# EAGLE schematic Schematic (EAGLE 9.1.3)
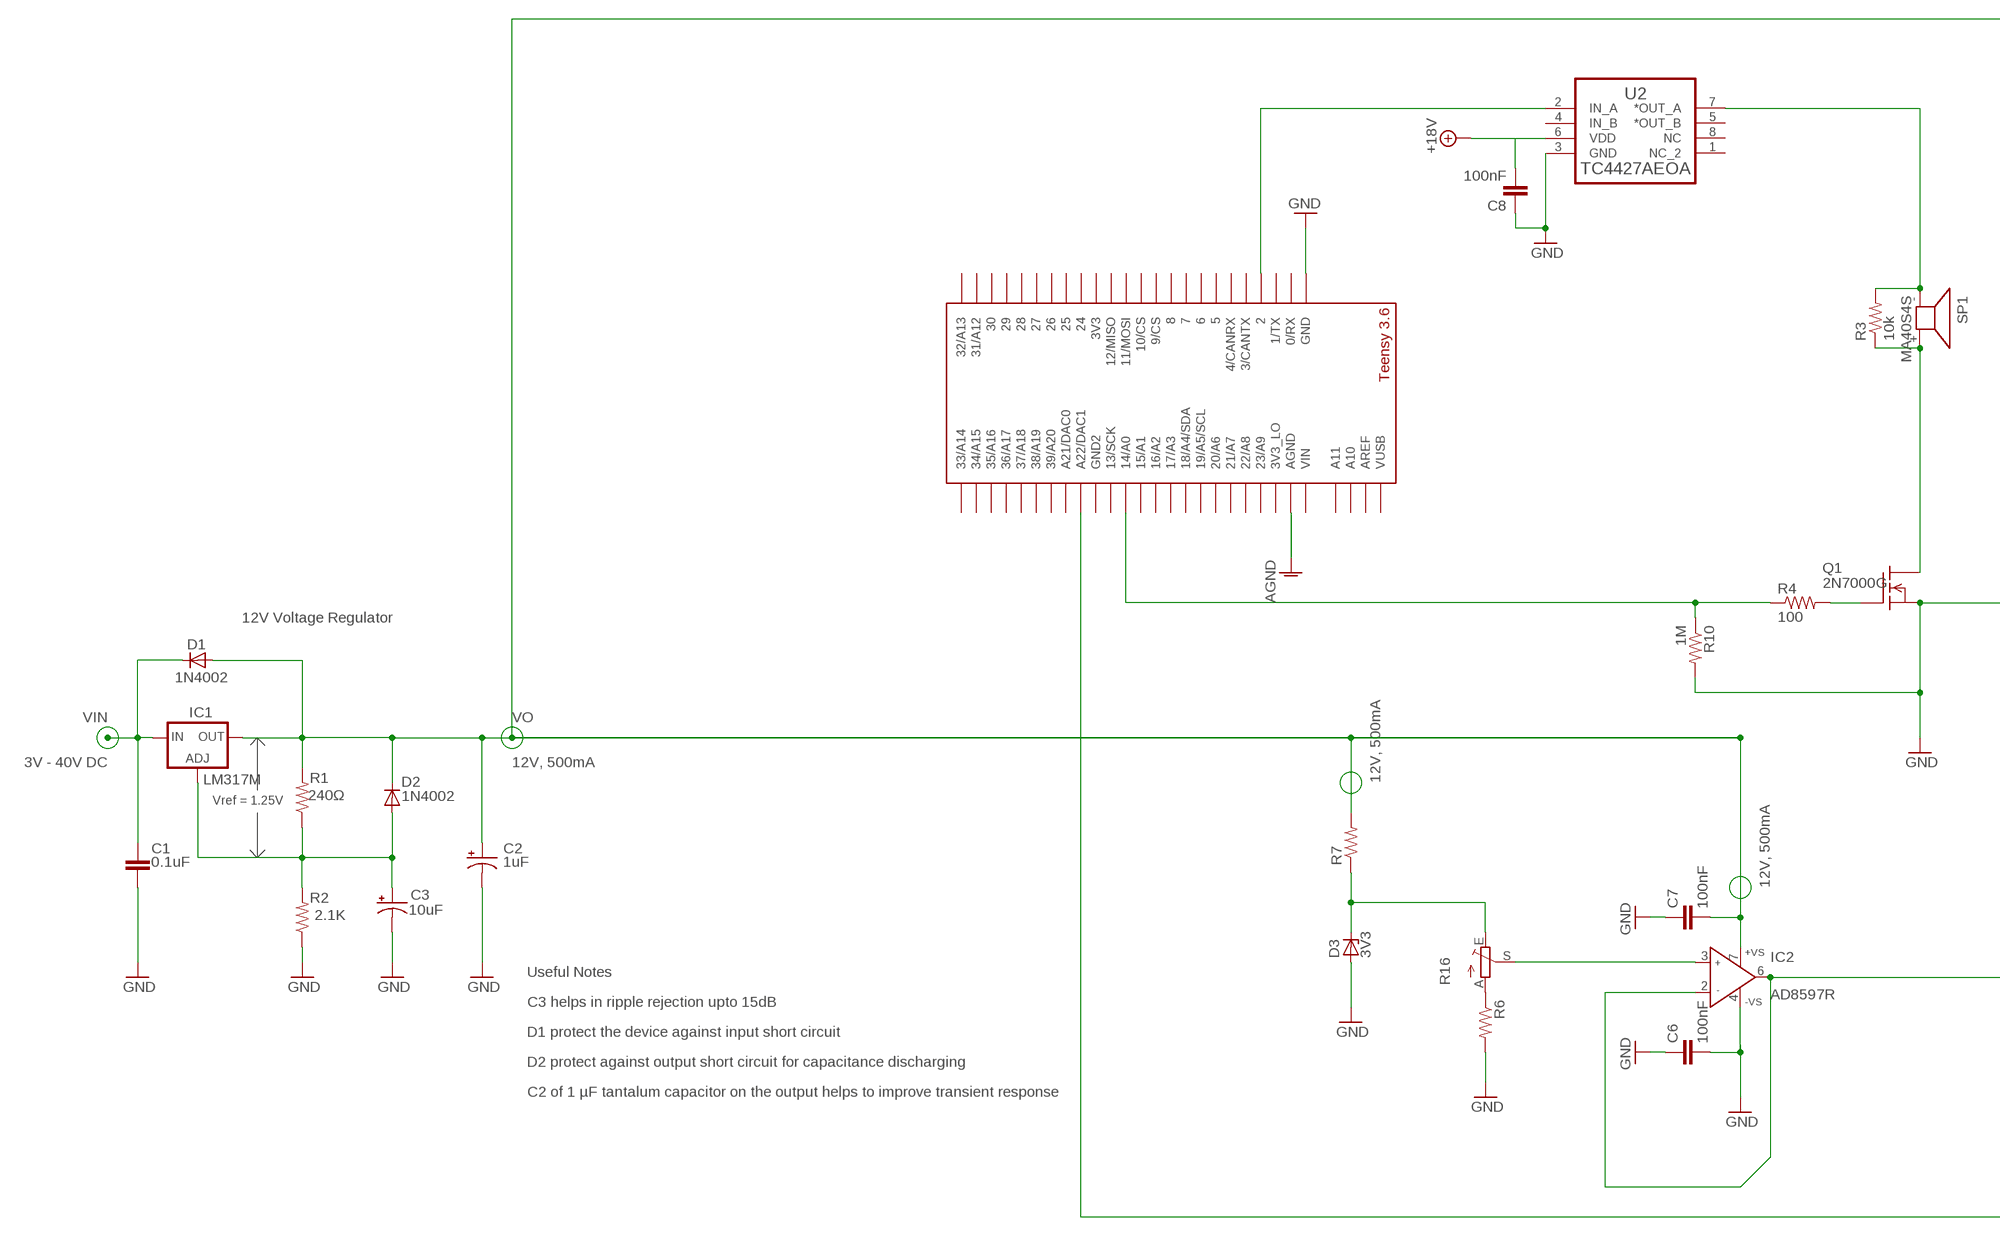
[diagram p0: schematic, sheet 1, part 1 of 2]
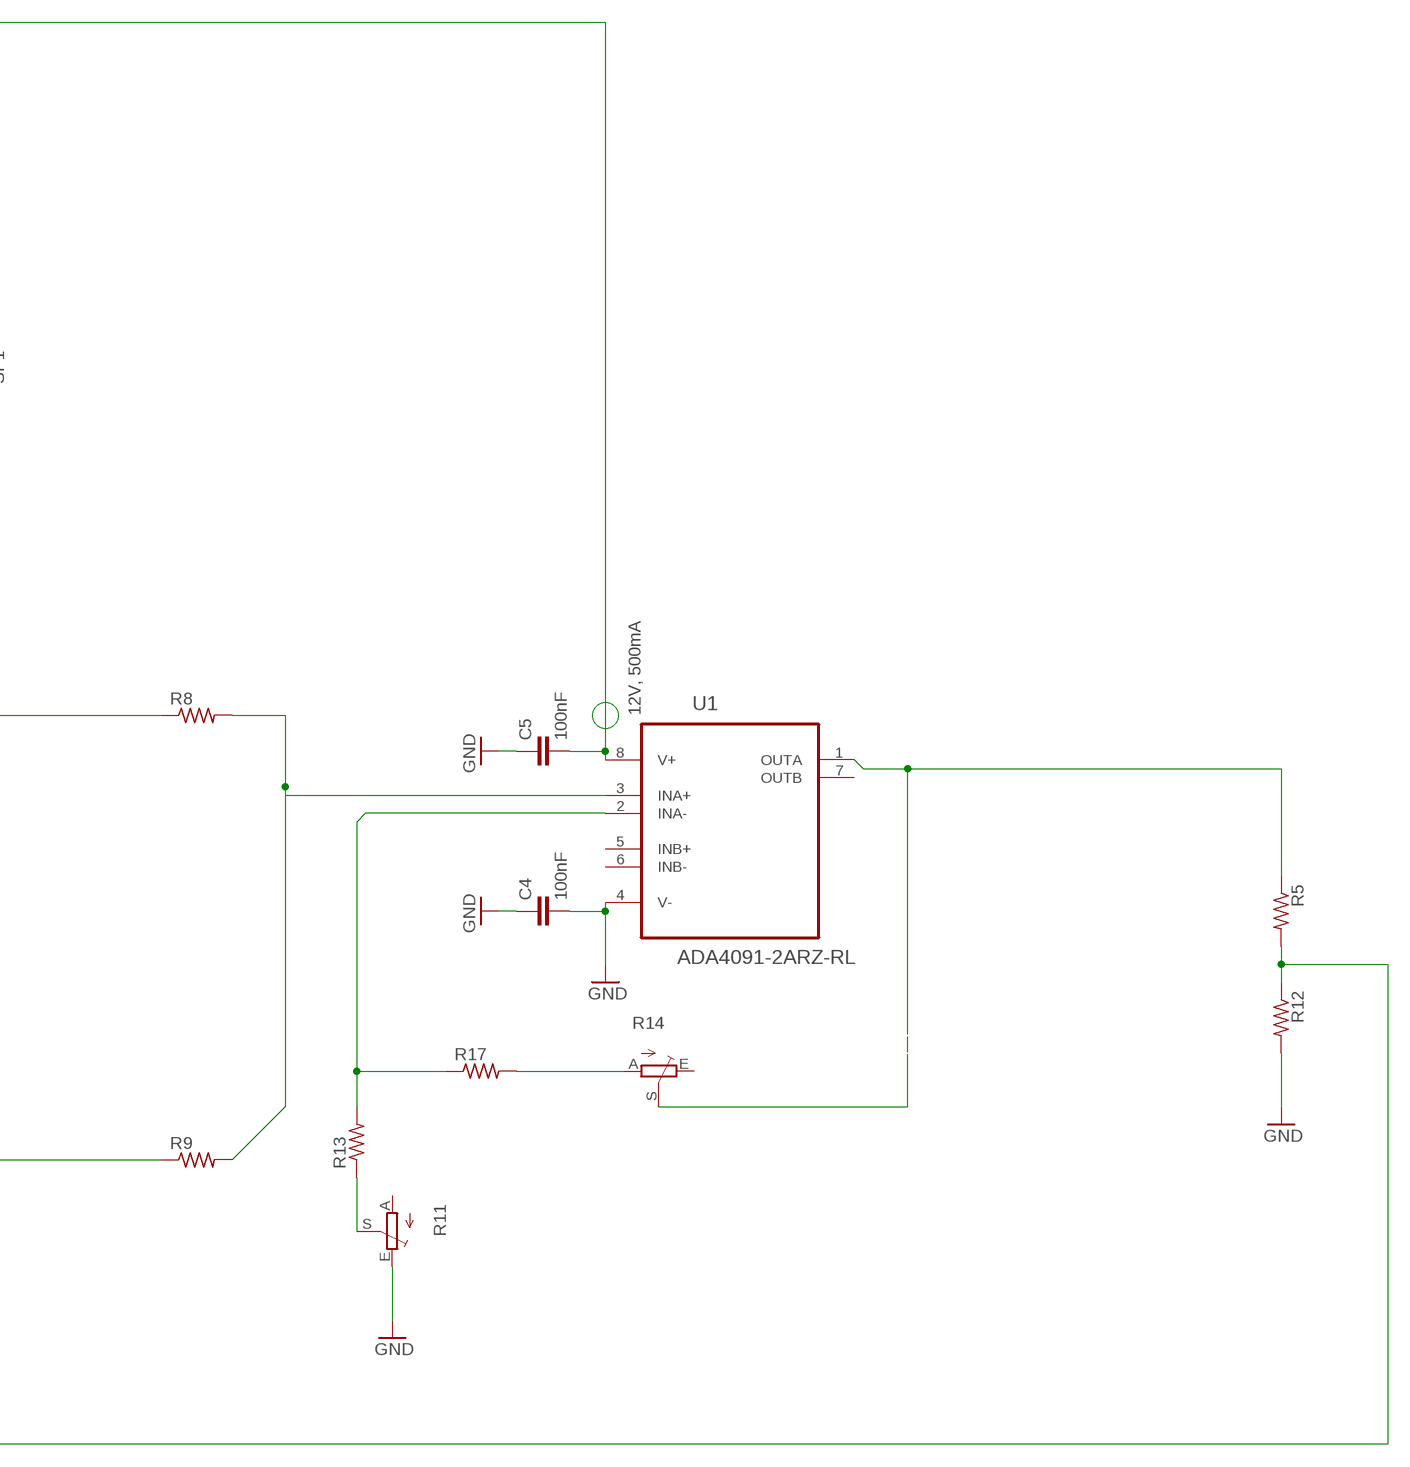
[diagram p1: schematic, sheet 1, part 2 of 2]

## Parts
C1  0.1uF  C-EU075-052X106  [C075-052X106]
C2  1uF  CPOL-US085CS-1AR  [085CS_1AR]
C3  10uF  CPOL-US085CS-1AR  [085CS_1AR]
C4  100nF  C2,5-3  [C2.5-3]
C5  100nF  C2,5-3  [C2.5-3]
C6  100nF  C2,5-3  [C2.5-3]
C7  100nF  C2,5-3  [C2.5-3]
C8  100nF  C2,5-3  [C2.5-3]
D1  1N4002  1N4004  [DO41-10]
D2  1N4002  1N4004  [DO41-10]
D3  3V3  1N4728  [DO41Z10]
IC1  LM317MBSTT3  [SOT223]
IC2  AD8597R  [SO8]
Q1  2N7000G  [TO92-INLINE]
R1  240Ω  R-US_M0805  [M0805]
R2  2.1K  R-US_M0805  [M0805]
R3  10k  R-US_R0805  [R0805]
R4  100  R-US_M0805  [M0805]
R5  R-US_M0805  [M0805]
R6  R-US_M0805  [M0805]
R7  R-US_M0805  [M0805]
R8  R-US_M0805  [M0805]
R9  R-US_M0805  [M0805]
R10  1M  R-US_M0805  [M0805]
R11  TRIM_EU-CA6V  [CA6V]
R12  R-US_M0805  [M0805]
R13  R-US_M0805  [M0805]
R14  TRIM_EU-CA6V  [CA6V]
R16  TRIM_EU-CA6V  [CA6V]
R17  R-US_M0805  [M0805]
SP1  MA40S4S  [MA40]
U1  ADA4091-2ARZ-RL  [SOIC127P600X175-8N]
U2  TC4427AEOA  [SOIC127P600X175-8N]
U$1  TEENSY_3.5/3.6_BASIC  [TEENSY_3.5/3.6_BASIC]

## Nets
+18V: U2.6(VDD)
AGND: U$1.AGND
GND: C1.2 C2.- C3.- C4.1 C4.2 C5.1 C6.1 C6.2 C7.1 C8.1 D3.A IC2.4(-VS) Q1.1(SRC) R2.1 R6.2 R8.1 R10.2 R11.E R12.2 U1.4(V-) U2.3(GND) U$1.GND
N$1: C3.+ D2.A IC1.1(ADJ) R1.1 R2.2
N$2: U2.2(IN_A) U$1.2
N$3: R3.2 SP1.- U2.7(*OUT_A)
N$4: Q1.3(DRN) R3.1 SP1.+
N$5: Q1.2(GATE) R4.2
N$6: R4.1 R10.1 U$1.14/A0
N$7: R8.2 R9.2 U1.3(INA+)
N$9: IC2.2(IN-) IC2.6(OUT) R9.1
N$10: IC2.3(IN+) R16.S
N$12: C8.2
N$13: R6.1 R16.A
N$14: D3.C R7.1 R16.E
N$16: R13.2 R17.1 U1.2(INA-)
N$17: R5.1 U1.1(OUTA)
N$18: R5.2 R12.1 U$1.A22/DAC1
N$19: R14.S
N$21: R11.S R13.1
N$22: R14.A R17.2
VIN: C1.1 D1.C IC1.3(IN)
VO: C2.+ C5.2 C7.2 D1.A D2.C IC1.4(OUT) IC2.7(+VS) R1.2 R7.2 U1.8(V+)
Unconnected: R11.A R14.E U1.5(INB+) U1.6(INB-) U1.7(OUTB) U2.1(NC_2) U2.4(IN_B) U2.5(*OUT_B) U2.8(NC) U$1.0/RX U$1.1/TX U$1.3/CANTX U$1.3V3 U$1.3V3_LO U$1.4/CANRX U$1.5 U$1.6 U$1.7 U$1.8 U$1.9/CS U$1.10/CS U$1.11/MOSI U$1.12/MISO U$1.13/SCK U$1.15/A1 U$1.16/A2 U$1.17/A3 U$1.18/A4/SDA U$1.19/A5/SCL U$1.20/A6 U$1.21/A7 U$1.21/DAC0(A21/DAC0) U$1.22/A8 U$1.23/A9 U$1.24 U$1.25 U$1.26 U$1.27 U$1.28 U$1.29 U$1.30 U$1.31/A12 U$1.32/A13 U$1.33/A14 U$1.34/A15 U$1.35/A16 U$1.36/A17 U$1.37/A18 U$1.38/A19 U$1.39/A20 U$1.A10 U$1.A11 U$1.AREF U$1.GND2 U$1.VIN U$1.VUSB

## Notes on the sheet
- 12V, 500mA
- 12V Voltage Regulator
- 3V - 40V DC | 12V, 500mA
- 12V, 500mA
- Vref = 1.25V
- 12V, 500mA
- Useful Notes
- C3 helps in ripple rejection upto 15dB
- D1 protect the device against input short circuit
- D2 protect against output short circuit for capacitance discharging
- C2 of 1 µF tantalum capacitor on the output helps to improve transient response

## Library data of the parts
C1 = rcl:C-EU: CAPACITOR, European symbol
C2 C3 = resistor:CPOL-US: POLARIZED CAPACITOR, American symbol
C4-C8 = capacitor-wima:C: CAPACITOR naming: grid - package width
D1 D2 = diode:1N4004: DIODE general purpose rectifier, 1 A
D3 = diode:1N4728: Z DIODE 3.3 V, 1W, 5 percent
IC1 = v-reg:LM317?*: 500 mA Adjustable Output Positive Voltage Regulator Source: http://www.onsemi.co.jp .. LM317M-D.PDF; PARTNUMBER: LM317M
IC2 = analog-devices:AD8597: Single and Dual, Ultralow Distortion, Ultralow Noise Op Amps Source: http://www.analog.com/static/imported-files/data_sheets/AD8597_8599.pdf; MPN: AD8597ARZ; OC_FARNELL: 1701258; OC_NEWARK: 19P8303
Q1 = 2N7000G:2N7000G: N-Channel Enhancement MOSFET 60V; 200mA; 5 ohm; AVAILABILITY: Unavailable; DESCRIPTION: Mosfet n-Channel Enhancement Mode 60v 5; MF: Microchip; MP: 2N7000-G; PACKAGE: TO-92 Supertex; PRICE: None
R1-R10 R12 R13 R17 = resistor:R-US_: RESISTOR, American symbol
R11 R14 R16 = pot:TRIM_EU-: POTENTIOMETER
SP1 = Parts:MA40S4S: SPEAKER Source: Buerklin
U1 = ADA4091-2ARZ-RL:ADA4091-2ARZ-RL: Precision Micropower Operational Amplifier; AVAILABILITY: Unavailable; DESCRIPTION: Ic Opamp Gp 1.27mhz Rro 8soic; MF: Analog; MP: ADA4091-2ARZ-RL; PACKAGE: SOIC-8 Analog Devices; PRICE: 3.30 USD
U2 = Parts:TC4427AEOA: IC, MOSFET DRIVER, LOW SIDE; MPN: TC4427AEOA; OC_FARNELL: 1292285; OC_NEWARK: 96K4020; PACKAGE: SOIC-8; SUPPLIER: Microchip
U$1 = Teensy356:TEENSY_3.5/3.6_BASIC